# Altium schematic sheet 07_Misc_2.SchDoc: Misc 2 (part 1 of 2)
size A3; Organization: Lime Microsystems; Address1: Surrey Tech Centre; Address2: Guildford GU2 7YG; Address3: Surrey; Address4: United Kingdom; SheetNumber: 7
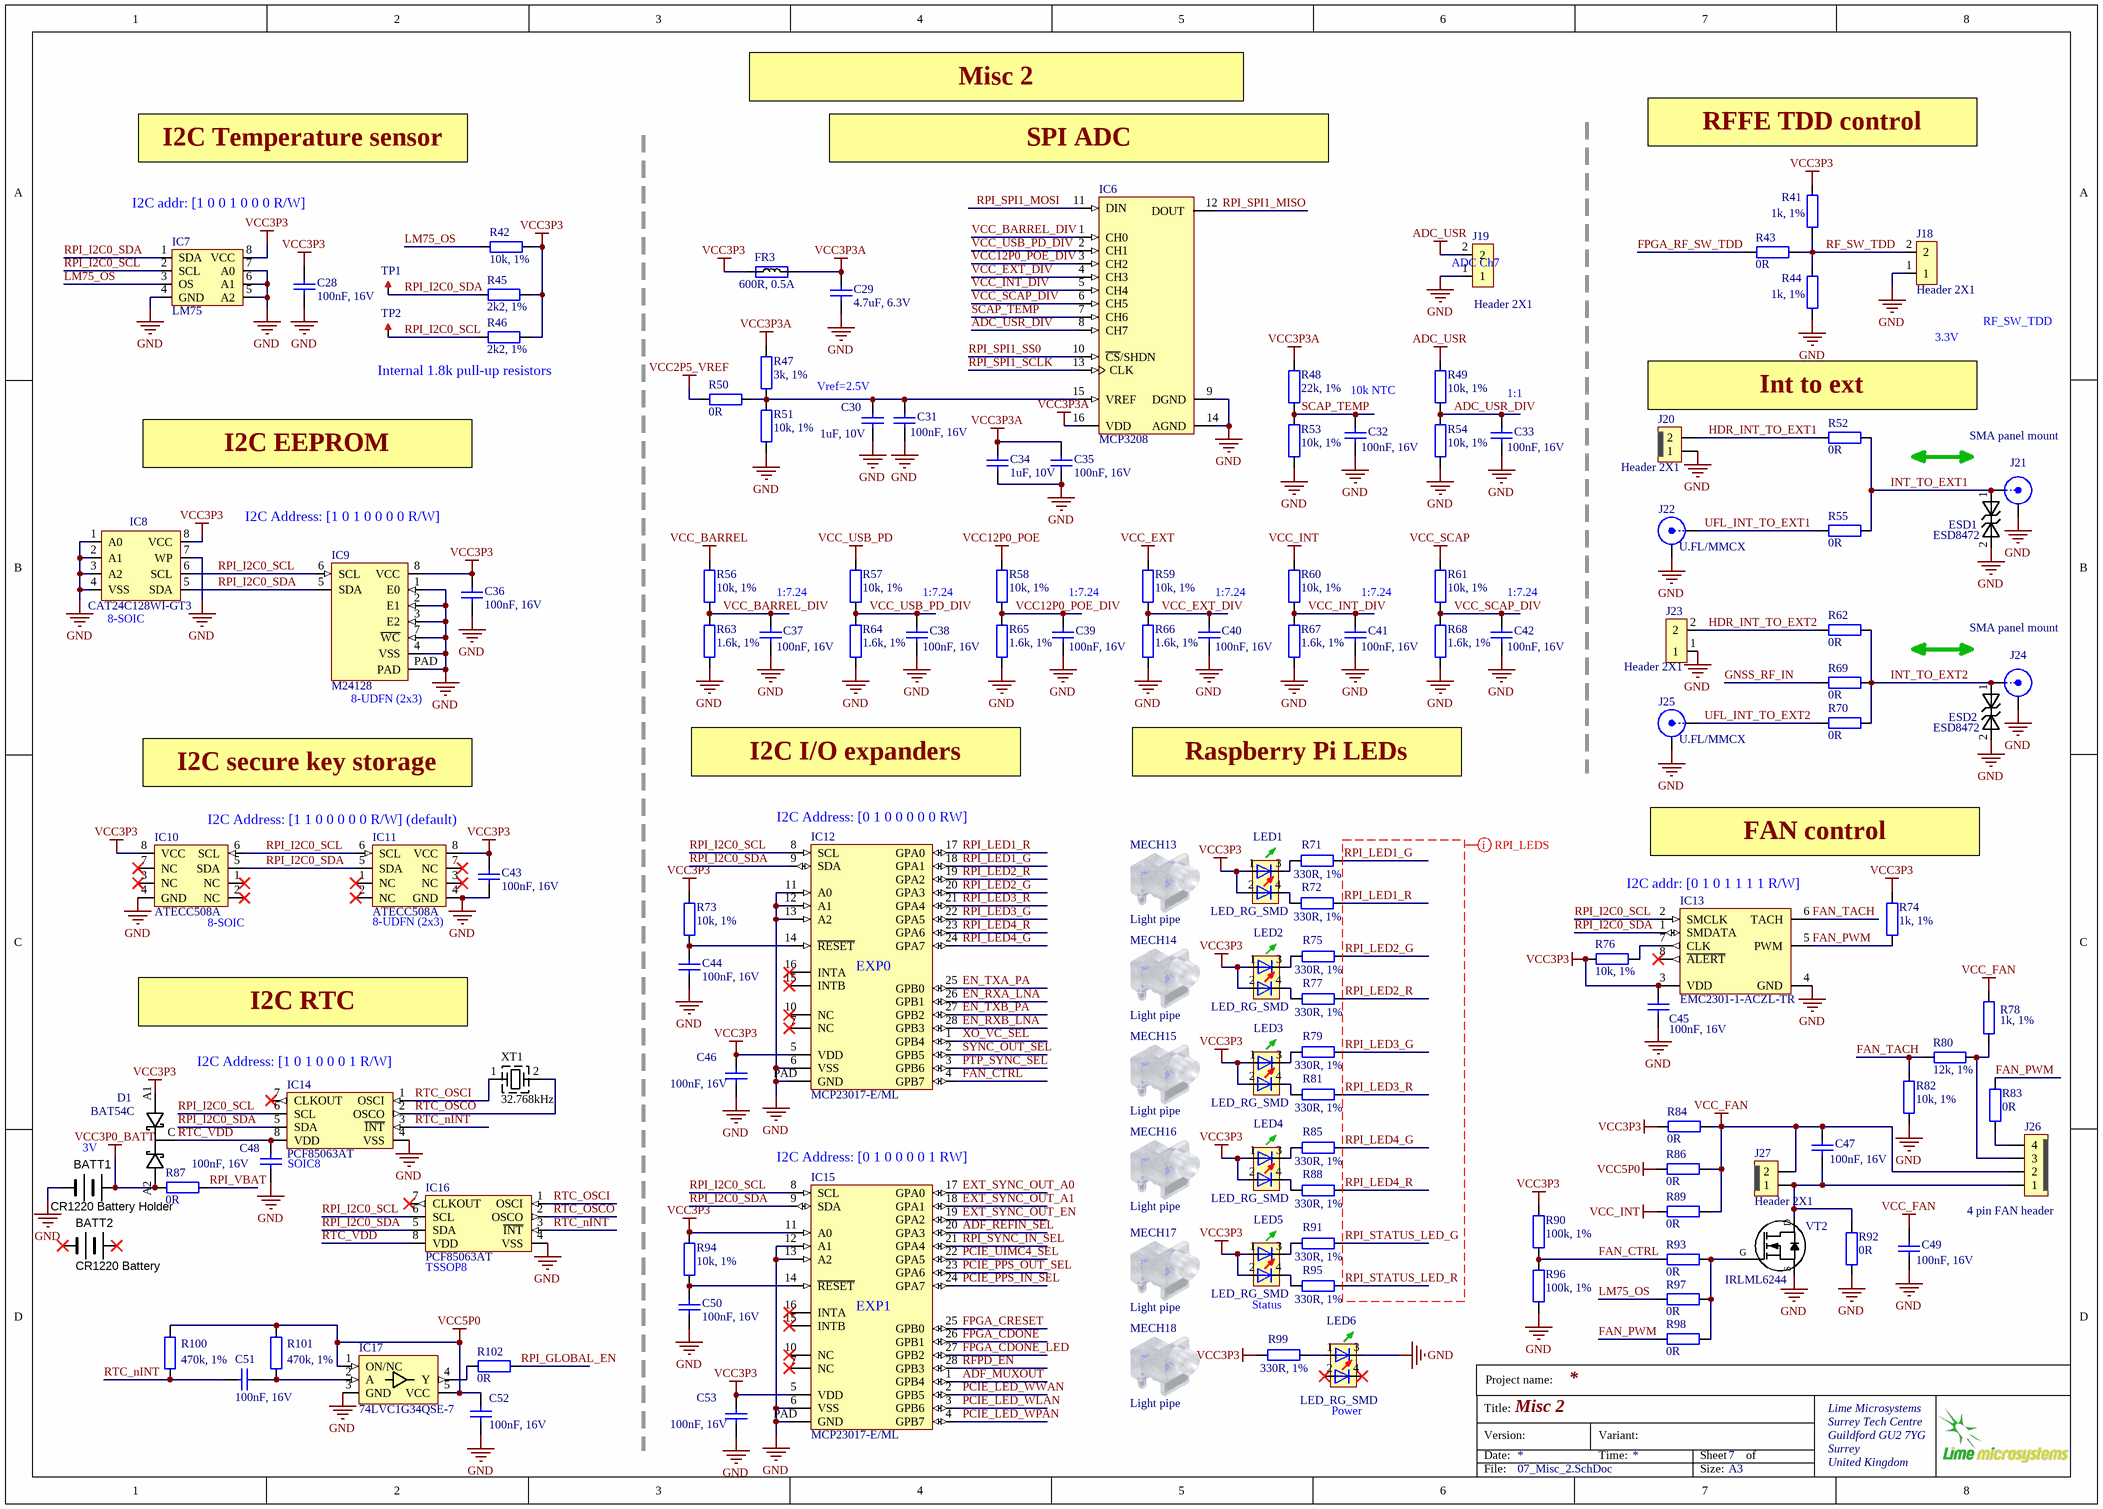
[diagram p0: 07_Misc_2.SchDoc]

## Parts
BATT1  CR1220 Battery Holder  [CR1220_SMD_holder]
BATT2  CR1220 Battery  (mechanical)
C28  100nF, 16V  [CAP0402]
C29  4.7uF, 6.3V  [CAP0402]
C30  1uF, 10V  [CAP0402]
C31  100nF, 16V  [CAP0402]
C32  100nF, 16V  [CAP0402]
C33  100nF, 16V  [CAP0402]
C34  1uF, 10V  [CAP0402]
C35  100nF, 16V  [CAP0402]
C36  100nF, 16V  [CAP0402]
C37  100nF, 16V  [CAP0402]
C38  100nF, 16V  [CAP0402]
C39  100nF, 16V  [CAP0402]
C40  100nF, 16V  [CAP0402]
C41  100nF, 16V  [CAP0402]
C42  100nF, 16V  [CAP0402]
C43  100nF, 16V  [CAP0402]
C44  100nF, 16V  [CAP0402]
C45  100nF, 16V  [CAP0402]
C46  100nF, 16V  [CAP0402]
C47  100nF, 16V  [CAP0402]
C48  100nF, 16V  [CAP0402]
C49  100nF, 16V  [CAP0402]
C50  100nF, 16V  [CAP0402]
C51  100nF, 16V  [CAP0402]
C52  100nF, 16V  [CAP0402]
C53  100nF, 16V  [CAP0402]
D1  BAT54C  [BAT54C_SOT23-3]
ESD1  ESD8472  [ESD8472_X3DFN2]
ESD2  ESD8472  [ESD8472_X3DFN2]
FR3  600R, 0.5A  [RES0402]
IC6  MCP3208  [MCP3208-CI/SL_SOIC16]
IC7  LM75  [HWSON8_LM75]
IC8  CAT24C128WI-GT3  [SOIC127P600-8DL_v2]
IC9  M24128  [M24128-DFMC6TG]
IC10  ATECC508A  [SOIC127P600-8DL_v2]
IC11  ATECC508A  [ATECC508A_UDFN8]
IC12  MCP23017-E/ML  [MCP23017-E/ML_QFN28]
IC13  EMC2301-1-ACZL-TR  [EMC2301-1-ACZL-TR_MOTOR_DRIVER_TSSOP8]
IC14  PCF85063AT  [PCF85063AT_RTC_SOIC-8]
IC15  MCP23017-E/ML  [MCP23017-E/ML_QFN28]
IC16  PCF85063AT  [PCF85063AT_RTC_TSSOP8]
IC17  74LVC1G34QSE-7  [74AHCT1G126SE-7_BUFFER_SOT353]
J18  Header 2X1  [HDR_1x2]
J19  Header 2X1  [HDR_1x2]
J20  Header 2X1  [Header1x2_TH_LOCKING]
J21  SMA panel mount  [SMA_connector_side]
J22  U.FL/MMCX  [MMCX_UFL_conn_u]
J23  Header 2X1  [HDR_1x2]
J24  SMA panel mount  [SMA_connector_side]
J25  U.FL/MMCX  [MMCX_UFL_conn_u]
J26  4 pin FAN header  [Header1x4_TH_LOCKING_v2]
J27  Header 2X1  [Header1x2_TH_LOCKING]
LED1  LED_RG_SMD  [LED-2x0603]
LED2  LED_RG_SMD  [LED-2x0603]
LED3  LED_RG_SMD  [LED-2x0603]
LED4  LED_RG_SMD  [LED-2x0603]
LED5  LED_RG_SMD  [LED-2x0603]
LED6  LED_RG_SMD  [LED-2x0603]
MECH13  Light pipe  [LIGHT_PIPE_RIGHT_ANGLE_SLP3-200-100-F]
MECH14  Light pipe  [LIGHT_PIPE_RIGHT_ANGLE_SLP3-200-100-F]
MECH15  Light pipe  [LIGHT_PIPE_RIGHT_ANGLE_SLP3-200-100-F]
MECH16  Light pipe  [LIGHT_PIPE_RIGHT_ANGLE_SLP3-200-100-F]
MECH17  Light pipe  [LIGHT_PIPE_RIGHT_ANGLE_SLP3-200-100-F]
MECH18  Light pipe  [LIGHT_PIPE_RIGHT_ANGLE_SLP3-200-100-F]
R41  1k, 1%  [RES0402]
R42  10k, 1%  [RES0402]
R43  0R  [RES0402]
R44  1k, 1%  [RES0402]
R45  2k2, 1%  [RES0402]
R46  2k2, 1%  [RES0402]
R47  3k, 1%  [RES0402]
R48  22k, 1%  [RES0402]
R49  10k, 1%  [RES0402]
R50  0R  [RES0402_v2]
R51  10k, 1%  [RES0402]
R52  0R  [RES0402_v2]
R53  10k, 1%  [RES0402]
R54  10k, 1%  [RES0402]
R55  0R  [RES0402_v2]
R56  10k, 1%  [RES0402]
R57  10k, 1%  [RES0402]
R58  10k, 1%  [RES0402]
R59  10k, 1%  [RES0402]
R60  10k, 1%  [RES0402]
R61  10k, 1%  [RES0402]
R62  0R  [RES0402_v2]
R63  1.6k, 1%  [RES0402]
R64  1.6k, 1%  [RES0402]
R65  1.6k, 1%  [RES0402]
R66  1.6k, 1%  [RES0402]
R67  1.6k, 1%  [RES0402]
R68  1.6k, 1%  [RES0402]
R69  0R  [RES0402_v2]
R70  0R  [RES0402_v2]
R71  330R, 1%  [RES0402]
R72  330R, 1%  [RES0402]
R73  10k, 1%  [RES0402]
R74  1k, 1%  [RES0402]
R75  330R, 1%  [RES0402]
R76  10k, 1%  [RES0402]
R77  330R, 1%  [RES0402]
R78  1k, 1%  [RES0402]
R79  330R, 1%  [RES0402]
R80  12k, 1%  [RES0402]
R81  330R, 1%  [RES0402]
R82  10k, 1%  [RES0402]
R83  0R  [RES0402]
R84  0R  [RES0402]
R85  330R, 1%  [RES0402]
R86  0R  [RES0402]
R87  0R  [RES0402]
R88  330R, 1%  [RES0402]
R89  0R  [RES0402]
R90  100k, 1%  [RES0402]
R91  330R, 1%  [RES0402]
R92  0R  [RES0402]
R93  0R  [RES0402]
R94  10k, 1%  [RES0402]
R95  330R, 1%  [RES0402]
R96  100k, 1%  [RES0402]
R97  0R  [RES0402]
R98  0R  [RES0402]
R99  330R, 1%  [RES0402]
R100  470k, 1%  [RES0402]
R101  470k, 1%  [RES0402]
R102  0R  [RES0402]
TP1  TESTPOINT_PAD  [TP_PAD_1p5MM]  (value not drawn)  (no BOM)
TP2  TESTPOINT_PAD  [TP_PAD_1p5MM]  (value not drawn)  (no BOM)
VT2  IRLML6244  [SOT23-3]
XT1  32.768kHz  [CRYSTAL_2PIN_RTC_RT3215]

## Nets
ADC_USR: J19.2 R49.1
GND: BATT1.NEGATIVE C28.2 C29.1 C30.1 C31.2 C32.2 C33.2 C34.1 C35.1 C36.2 C37.2 C38.2 C39.2 C40.2 C41.2 C42.2 C43.2 C44.2 C45.2 C46.2 C48.2 C49.2 C50.2 C52.2 C53.2 ESD1.2 ESD2.2 IC6.9(DGND) IC6.14(AGND) IC7.4(GND) IC7.5(A2) IC7.6(A1) IC7.7(A0) IC8.1(A0) IC8.2(A1) IC8.3(A2) IC8.4(VSS) IC8.7(WP) IC9.1(E0) IC9.2(E1) IC9.3(E2) IC9.4(VSS) IC9.7(~{WC}) IC9.PAD IC10.4(GND) IC11.4(GND) IC12.6(VSS) IC12.11(A0) IC12.12(A1) IC12.13(A2) IC12.PAD(GND) IC13.4(GND) IC14.4(VSS) IC15.6(VSS) IC15.12(A1) IC15.13(A2) IC15.PAD(GND) IC16.4(VSS) IC17.3(GND) J18.1 J19.1 J20.1 J21.2(Y) J22.2(Y) J23.1 J24.2(Y) J25.2(Y) LED6.3 R44.2 R51.2 R53.2 R54.2 R63.1 R64.1 R65.1 R66.1 R67.1 R68.1 R82.2 R92.1 R96.2 VT2.S
VCC2P5_VREF: R50.1
VCC3P0_BATT: BATT1.POSITIVE D1.A2 R87.2
VCC3P3: C28.1 C36.1 C43.1 C45.1 C46.1 C53.1 D1.A1 FR3.1 IC7.8(VCC) IC8.8(VCC) IC9.8(VCC) IC10.8(VCC) IC11.8(VCC) IC12.5(VDD) IC13.3(VDD) IC15.5(VDD) IC15.11(A0) LED1.1 LED1.2 LED2.1 LED2.2 LED3.1 LED3.2 LED4.1 LED4.2 LED5.1 LED5.2 R41.1 R42.2 R45.2 R46.2 R73.2 R74.2 R76.1 R84.1 R90.1 R94.2 R99.2
VCC3P3A: C29.2 C34.2 C35.2 FR3.2 IC6.16(VDD) R47.2 R48.1
VCC5P0: C52.1 IC17.1(ON/NC) IC17.5(VCC) R86.1 R100.2 R101.2
VCC12P0_POE: R58.1
VCC_BARREL: R56.1
VCC_EXT: R59.1
VCC_FAN: C47.1 C49.1 J26.2 J27.2 R78.1 R84.2 R86.2 R89.2
VCC_INT: R60.1 R89.1
VCC_SCAP: R61.1
VCC_USB_PD: R57.1
ADC_USR_DIV: C33.1 IC6.8(CH7) R49.2 R54.1
ADF_MUXOUT: IC15.1(GPB4)
ADF_REFIN_SEL: IC15.20(GPA3)
EN_RXA_LNA: IC12.26(GPB1)
EN_RXB_LNA: IC12.28(GPB3)
EN_TXA_PA: IC12.25(GPB0)
EN_TXB_PA: IC12.27(GPB2)
EXT_SYNC_OUT_A0: IC15.17(GPA0)
EXT_SYNC_OUT_A1: IC15.18(GPA1)
EXT_SYNC_OUT_EN: IC15.19(GPA2)
FAN_CTRL: IC12.4(GPB7) R90.2 R93.1 R96.1
FAN_PWM: IC13.5(PWM) R74.1 R83.2 R98.1
FAN_TACH: IC13.6(TACH) R80.2 R82.1
FPGA_CDONE: IC15.26(GPB1)
FPGA_CDONE_LED: IC15.27(GPB2)
FPGA_CRESET: IC15.25(GPB0)
FPGA_RF_SW_TDD: R43.2
GNSS_RF_IN: R69.2
HDR_INT_TO_EXT1: J20.2 R52.2
HDR_INT_TO_EXT2: J23.2 R62.2
INT_TO_EXT1: ESD1.1 J21.1(X) R52.1 R55.1
INT_TO_EXT2: ESD2.1 J24.1(X) R62.1 R69.1 R70.1
LM75_OS: IC7.3(OS) R42.1 R97.1
PCIE_LED_WLAN: IC15.3(GPB6)
PCIE_LED_WPAN: IC15.4(GPB7)
PCIE_LED_WWAN: IC15.2(GPB5)
PCIE_PPS_IN_SEL: IC15.24(GPA7)
PCIE_PPS_OUT_SEL: IC15.23(GPA6)
PCIE_UIMC4_SEL: IC15.22(GPA5)
PTP_SYNC_SEL: IC12.3(GPB6)
RF_SW_TDD: J18.2 R41.2 R43.1 R44.1
RFPD_EN: IC15.28(GPB3)
RPI_GLOBAL_EN: R102.1
RPI_I2C0_SCL: IC7.2(SCL) IC8.6(SCL) IC9.6(SCL) IC10.6(SCL) IC11.6(SCL) IC12.8(SCL) IC13.2(SMCLK) IC14.6(SCL) IC15.8(SCL) IC16.6(SCL) R46.1 TP2.1
RPI_I2C0_SDA: IC7.1(SDA) IC8.5(SDA) IC9.5(SDA) IC10.5(SDA) IC11.5(SDA) IC12.9(SDA) IC13.1(SMDATA) IC14.5(SDA) IC15.9(SDA) IC16.5(SDA) R45.1 TP1.1
RPI_LED1_G: IC12.18(GPA1) R71.1
RPI_LED1_R: IC12.17(GPA0) R72.1
RPI_LED2_G: IC12.20(GPA3) R75.1
RPI_LED2_R: IC12.19(GPA2) R77.1
RPI_LED3_G: IC12.22(GPA5) R79.1
RPI_LED3_R: IC12.21(GPA4) R81.1
RPI_LED4_G: IC12.24(GPA7) R85.1
RPI_LED4_R: IC12.23(GPA6) R88.1
RPI_SPI1_MISO: IC6.12(DOUT)
RPI_SPI1_MOSI: IC6.11(DIN)
RPI_SPI1_SCLK: IC6.13(CLK)
RPI_SPI1_SS0: IC6.10(~{CS}/SHDN)
RPI_STATUS_LED_G: R91.1
RPI_STATUS_LED_R: R95.1
RPI_SYNC_IN_SEL: IC15.21(GPA4)
RPI_VBAT: R87.1
RTC_nINT: C51.1 IC14.3(~{INT}) IC16.3(~{INT}) R100.1
RTC_OSCI: IC14.1(OSCI) IC16.1(OSCI) XT1.1(X)
RTC_OSCO: IC14.2(OSCO) IC16.2(OSCO) XT1.2(X)
RTC_VDD: C48.1 D1.C IC14.8(VDD) IC16.8(VDD)
SCAP_TEMP: C32.1 IC6.7(CH6) R48.2 R53.1
SYNC_OUT_SEL: IC12.2(GPB5)
UFL_INT_TO_EXT1: J22.1(X) R55.2
UFL_INT_TO_EXT2: J25.1(X) R70.2
VCC12P0_POE_DIV: C39.1 IC6.3(CH2) R58.2 R65.2
VCC_BARREL_DIV: C37.1 IC6.1(CH0) R56.2 R63.2
VCC_EXT_DIV: C40.1 IC6.4(CH3) R59.2 R66.2
VCC_INT_DIV: C41.1 IC6.5(CH4) R60.2 R67.2
VCC_SCAP_DIV: C42.1 IC6.6(CH5) R61.2 R68.2
VCC_USB_PD_DIV: C38.1 IC6.2(CH1) R57.2 R64.2
XO_VC_SEL: IC12.1(GPB4)
NetC30_2: C30.2 C31.1 IC6.15(VREF) R47.1 R50.2 R51.1
NetC44_1: C44.1 IC12.14(~{RESET}) R73.1
NetC47_2: C47.2 J26.1 J27.1 R92.2 VT2.D
NetC50_1: C50.1 IC15.14(~{RESET}) R94.1
NetC51_2: C51.2 IC17.2(A) R101.1
NetIC13_7: IC13.7(CLK) R76.2
NetIC17_4: IC17.4(Y) R102.2
NetJ26_3: J26.3 R78.2 R80.1
NetJ26_4: J26.4 R83.1
NetLED1_3: LED1.3 R71.2
NetLED1_4: LED1.4 R72.2
NetLED2_3: LED2.3 R75.2
NetLED2_4: LED2.4 R77.2
NetLED3_3: LED3.3 R79.2
NetLED3_4: LED3.4 R81.2
NetLED4_3: LED4.3 R85.2
NetLED4_4: LED4.4 R88.2
NetLED5_3: LED5.3 R91.2
NetLED5_4: LED5.4 R95.2
NetLED6_1: LED6.1 R99.1
NetR93_2: R93.2 R97.2 R98.2 VT2.G

Not connected (* = marked no-connect by the designer): BATT2 NEGATIVE* POSITIVE*; IC10 1(NC)* 2(NC)* 3(NC)* 7(NC)*; IC11 1(NC)* 2(NC)* 3(NC)* 7(NC)*; IC12 7(NC)* 10(NC)* 15(INTB)* 16(INTA)*; IC13 8(~{ALERT})*; IC14 7(CLKOUT)*; IC15 7(NC)* 10(NC)* 15(INTB)* 16(INTA)*; IC16 7(CLKOUT)*; LED6 2* 4*

## Layout directives
net class RPI_LEDS: RPI_LED1_G, RPI_LED1_R, RPI_LED2_G, RPI_LED2_R, RPI_LED3_G, RPI_LED3_R, RPI_LED4_G, RPI_LED4_R, RPI_STATUS_LED_G, RPI_STATUS_LED_R

## Notes on the sheet
- Misc 2
- I2C Temperature sensor
- (near IC6) SPI ADC
- (near R41) RFFE TDD control
- I2C addr: [1 0 0 1 0 0 0 R/W]
- (near J19) ADC Ch7
- Internal 1.8k pull-up resistors
- 3.3V
- (near J18) RF_SW_TDD
- (near C30) Vref=2.5V
- 10k NTC
- (near C33) 1:1
- Int to ext
- I2C EEPROM
- I2C Address: [1 0 1 0 0 0 0 R/W]
- (near IC8) 8-SOIC
- 1:7.24
- (near C42) 1:7.24
- (near IC9) 8-UDFN (2x3)
- I2C secure key storage
- I2C I/O expanders
- Raspberry Pi LEDs
- I2C Address: [1 1 0 0 0 0 0 R/W] (default)
- (near IC12) I2C Address: [0 1 0 0 0 0 0 RW]
- FAN control
- (near IC11) 8-UDFN (2x3)
- (near IC13) I2C addr: [0 1 0 1 1 1 1 R/W]
- (near IC10) 8-SOIC
- (near IC12) EXP0
- I2C RTC
- (near IC14) I2C Address: [1 0 1 0 0 0 1 R/W]
- (near BATT1) 3V
- SOIC8
- (near IC15) I2C Address: [0 1 0 0 0 0 1 RW]
- (near IC16) TSSOP8
- (near IC15) EXP1
- Status
- (near LED6) Power
- Project name:
- Title:
- Version:
- Date:
- Variant:
- Time:
- Sheet
- of
- File:
- Size:
- A3